# EAGLE design relay_board_mech (EAGLE 6.5.0)
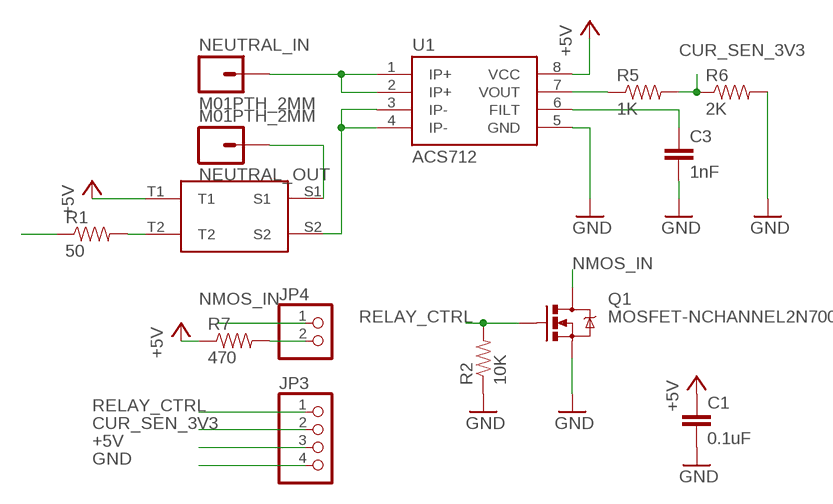
[diagram p0: schematic, sheet 1]

## Parts
C1  0.1uF  CAPEZ  [CAP-PTH-SMALLEZ]
C3  1nF  CAPEZ  [CAP-PTH-SMALLEZ]
JP3  PINHD-1X4  [1X04]
JP4  PINHD-1X2  [1X02]
NEUTRAL_IN  M01PTH_2MM  [1X01_2MM]
NEUTRAL_OUT  M01PTH_2MM  [1X01_2MM]
Q1  MOSFET-NCHANNEL2N7000  [TO-92]
R1  50  10KOHM1/6W5%(PTH)VERTICAL  [AXIAL-0.1]
R2  10K  10KOHM1/6W5%(PTH)VERTICAL  [AXIAL-0.1]
R5  1K  10KOHM1/6W5%(PTH)VERTICAL  [AXIAL-0.1]
R6  2K  10KOHM1/6W5%(PTH)VERTICAL  [AXIAL-0.1]
R7  470  10KOHM1/6W5%(PTH)VERTICAL  [AXIAL-0.1]
U1  ACS712  [SO08]
U$1  T77S1D10-05  [T77S1D10-05]

## Nets
+5V: C1.1 JP3.3 R7.P$1 U1.8(VCC) U$1.T1
CUR_SEN_3V3: JP3.2 R5.P$2 R6.P$1
CUR_SEN_5V: R5.P$1 U1.7(VOUT)
GND: C1.2 C3.2 JP3.4 Q1.1(S) R2.P$1 R6.P$2 U1.5(GND)
N$1: NEUTRAL_OUT.1 U$1.S1
N$2: R1.P$2 U$1.T2
N$4: C3.1 U1.6(FILT)
N$6: NEUTRAL_IN.1 U1.1(IP+) U1.2(IP+)
N$7: JP4.2 R7.P$2
N$8: U1.3(IP-) U1.4(IP-) U$1.S2
NMOS_IN: JP4.1 Q1.3(D) R1.P$1
RELAY_CTRL: JP3.1 Q1.2(G) R2.P$2

## Library data of the parts
C1 C3 = SparkFun-Passives:CAP: Capacitor Standard 0603 ceramic capacitor, and 0.1" leaded capacitor.
JP3 = pinhead:PINHD-1X4: PIN HEADER
JP4 = pinhead:PINHD-1X2: PIN HEADER
NEUTRAL_IN NEUTRAL_OUT = SparkFun:M01: Header 1 Standard 1-pin 0.1" header. Use with straight break away headers (SKU : PRT-00116), right angle break away headers (PRT-00553), swiss pins (PRT-00743), machine pins (PRT-00117), and female headers (PRT-00115).
Q1 = SparkFun-DiscreteSemi:MOSFET-NCHANNEL: Common NMOSFET Parts MFG P/N Store ID Prod ID FDD8780 TRANS-09984 SI7820DN TRANS-11055 FDS6630A IC-08089 2N7002PW TRANS-11151 FQP30N06L COM-10213 TRANS-10060 BSS123LT1G TRANS-08345 BSS138 TRANS-00830 BS170 2N7000
R1 R2 R5-R7 = vertical_resistor:10KOHM1/6W5%(PTH): RES-08375
U1 = SparkFun:ACS712
U$1 = T77S1D10-05:T77S1D10-05

## Net classes
0 default: width 0.508 mm, drill 0.508 mm, clearance 0.508 mm
1 High current: width 5.08 mm, drill 0.254 mm, clearance 1.27 mm

## Board
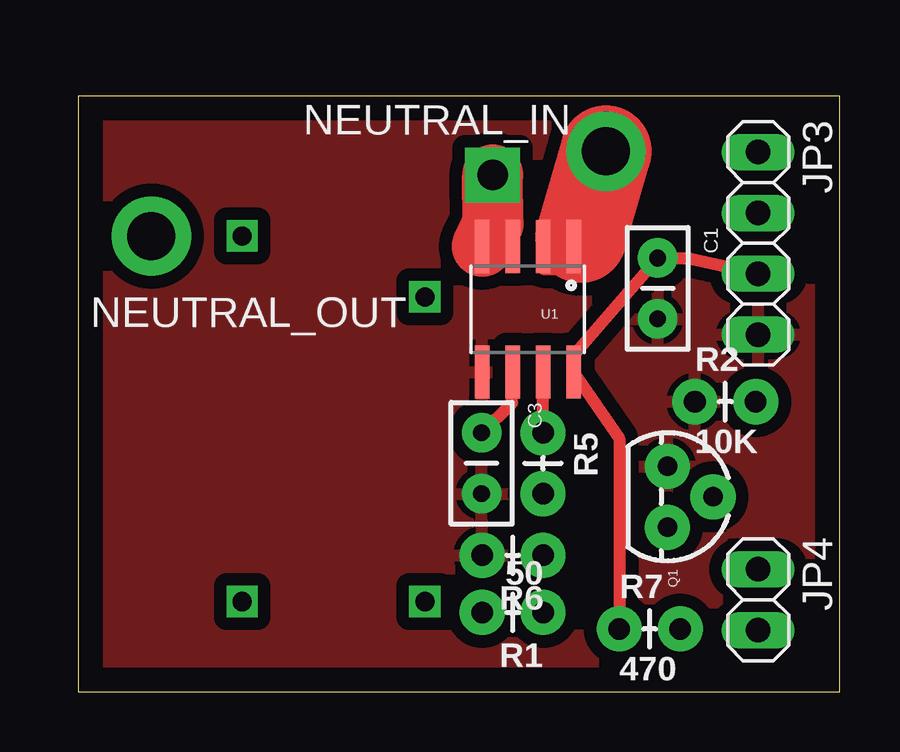
[diagram p1: board, top side]
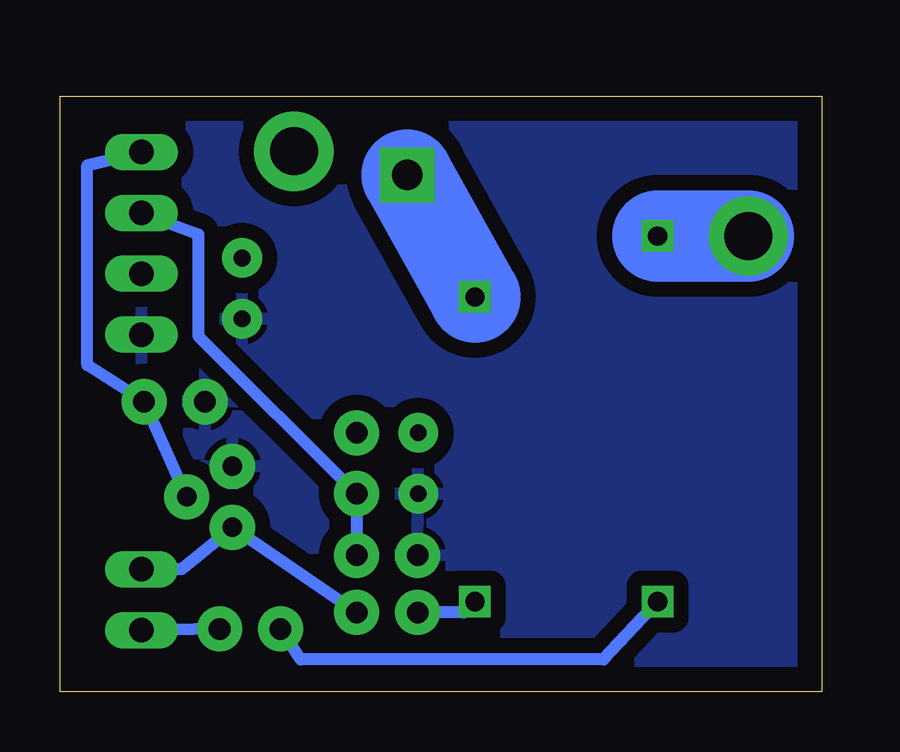
[diagram p2: board, bottom side, seen from below]

Size 31.75 x 24.83 mm. Coordinates in mm from the lower left corner, seen from the top.
Outline: 0,0 31.75,0 31.75,24.83 0,24.83 0,0
Copper layers (1*16): Top 0.035mm / dielectric 1.5mm / Bottom 0.035mm
Design rules "MWSEagleDesignRules2": minimum track width 13mil, minimum drill 22mil, track to track 13mil, track to pad 13mil, pad to pad 13mil, via to via 13mil, smd to smd 8mil, copper to edge 40mil, drill to drill 8mil, minimum pad ring 10mil, minimum via ring 8mil, stop-mask expansion 4mil, vias tented up to drill 0mil, thermal gap 10mil

### Footprints (pad centres in the part's own frame; a part is rotated, then mirrored left to right if it is on the bottom)
CAP-PTH-SMALLEZ = drill 0.7 pad 1.651: 1 0,0; 2 2.54,0
1X04 = drill 1.016 long: 1 -3.81,0; 2 -1.27,0; 3 1.27,0; 4 3.81,0
1X02 = drill 1.016 long: 1 -1.27,0; 2 1.27,0
1X01_2MM = drill 2 pad 3.302: 1 0,0
TO-92 = drill 0.813 pad 1.88: 1 -1.27,0; 2 0,1.905; 3 1.27,0
AXIAL-0.1 = drill 0.9 pad 1.88: P$1 0,0; P$2 2.54,0
SO08 = smd 0.61 x 2.21: 1 -1.905,-2.616; 2 -0.635,-2.616; 3 0.635,-2.616; 4 1.905,-2.616; 5 1.905,2.616; 6 0.635,2.616; 7 -0.635,2.616; 8 -1.905,2.616
T77S1D10-05 = drill 0.8 square: S1 7.62,3.81; S2 5.08,-3.81; T1 -7.62,3.81; T2 -7.62,-3.81

### Placement (x,y rotation side)
C1  24.16,18.08 270 top
C3  16.81,10.79 270 top
JP3  28.35,18.69 270 top
JP4  28.35,3.84 270 top
NEUTRAL_IN  22,22.53 0 top
NEUTRAL_OUT  3.05,19 0 top
Q1  24.56,8.13 270 top
R1  19.38,3.3 180 top
R2  25.7,12.09 0 top
R5  19.38,10.79 270 top
R6  19.38,5.69 180 top
R7  22.56,2.62 0 top
U1  18.75,15.95 180 top
U$1  10.64,11.38 90 top

### Tracks (layer width: path | path; a pad name or v marks a point on that pad's centre or on a via)
+5V
  Top 0.508: R7.P$1 22.55,10.57 U1.8 20.65,14.02 C1.1 25.43,18.09 JP3.3
  Bottom 0.508: U$1.T1 9.09,1.35 21.72,1.35 R7.P$1
CUR_SEN_3V3
  Bottom 0.508: JP3.2 25.98,19.07 25.98,14.83 R5.P$2 R6.P$1
CUR_SEN_5V
  Top 0.508: R5.P$1 U1.7
GND
  pour Top (isolate 0.533): -0.1,24.82 0.08,-0.05 31.78,-0.08 31.9,24.61
  pour Bottom (isolate 0.635): 0.08,24.94 0.2,0 31.98,-0.1 31.85,24.84
N$1
  Bottom 3.81: NEUTRAL_OUT.1 U$1.S1
N$2
  Bottom 0.508: U$1.T2 14.91,3.3 R1.P$2
N$4
  Top 0.508: C3.1 18.09,12.04 U1.6
N$6
  Top 0.508: 19.38,17.63 19.96,17.63 | 19.38,17.63 19.89,17.88 U1.2 | 19.38,17.63 U1.1 19.96,17.63 | 19.96,17.63 20.95,18.95
  Top 3.81: 20.95,18.95 NEUTRAL_IN.1
N$7
  Bottom 0.508: R7.P$2 JP4.2
N$8  (via drill 1.27)
  Top 0.508: 17.3,19.53 U1.3
  Top 2.54: U1.4 17.3,19.53 v17.27,21.54
  Bottom 3.81: U$1.S2 v17.27,21.54
NMOS_IN
  Bottom 0.508: JP4.1 26.7,5.11 Q1.3 R1.P$1
RELAY_CTRL
  Bottom 0.508: Q1.2 R2.P$2 30.61,13.61 30.61,21.95 JP3.1